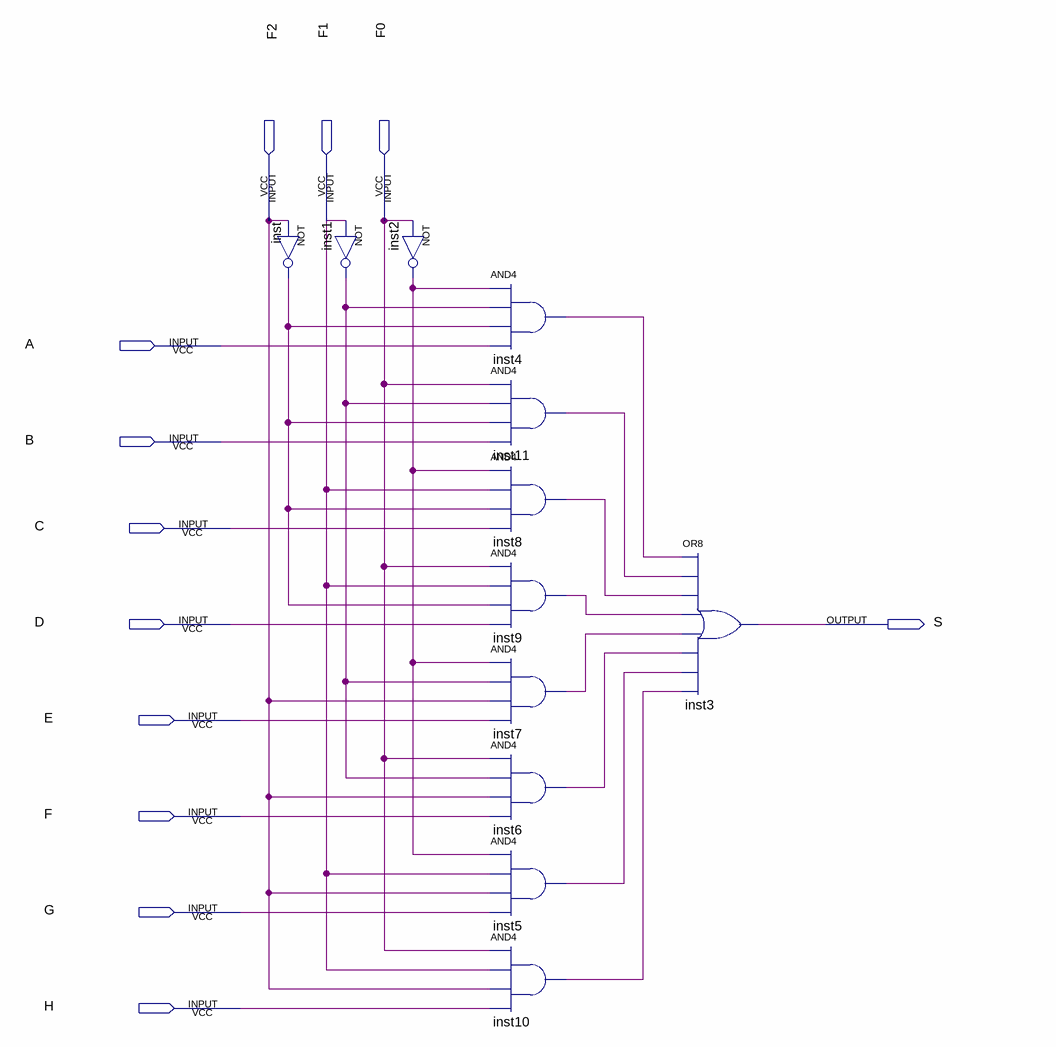
[diagram p0: schematic sheet]
// Quartus schematic MUX8.bdf as structural Verilog: 12 symbols, 12 pins
module MUX8 (
  input  F2,
  input  F1,
  input  F0,
  input  A,
  input  B,
  input  C,
  input  D,
  input  E,
  input  F,
  input  G,
  input  H,
  output S
);

  wire inst1_out, inst2_out, inst4_out, inst5_out, inst6_out, inst7_out, inst8_out, inst9_out, inst10_out,
       inst11_out, inst_out;

  not inst (inst_out, F2);
  not inst1 (inst1_out, F1);
  not inst2 (inst2_out, F0);
  and inst4 (inst4_out, inst2_out, inst1_out, inst_out, A);
  and inst11 (inst11_out, F0, inst1_out, inst_out, B);
  and inst8 (inst8_out, inst2_out, F1, inst_out, C);
  and inst9 (inst9_out, F0, F1, inst_out, D);
  and inst7 (inst7_out, inst2_out, inst1_out, F2, E);
  and inst6 (inst6_out, F0, inst1_out, F2, F);
  and inst5 (inst5_out, inst2_out, F1, F2, G);
  and inst10 (inst10_out, F0, F1, F2, H);
  or inst3 (S, inst4_out, inst11_out, inst8_out, inst9_out, inst7_out, inst6_out, inst5_out, inst10_out);
endmodule
